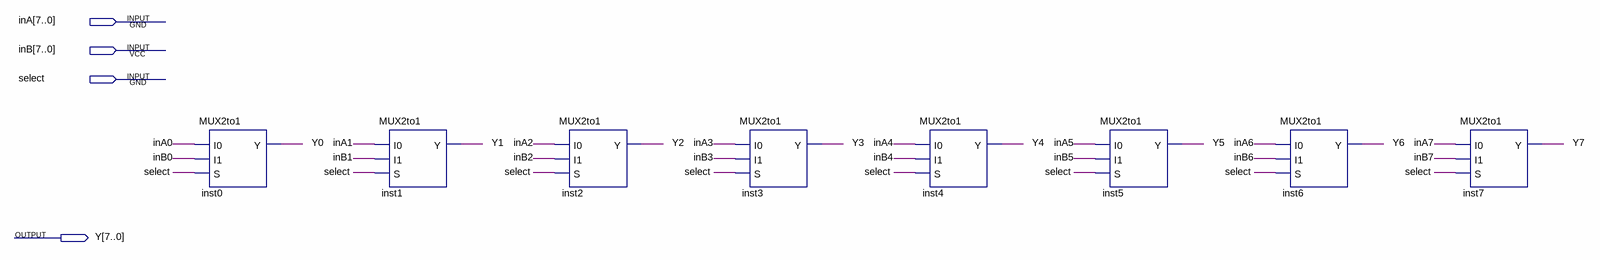
[diagram p0: schematic sheet]
// Quartus schematic MUX2to1BUS8.bdf as structural Verilog: 8 symbols, 4 pins
module MUX2to1BUS8 (
  input  [7:0] inA,
  input  [7:0] inB,
  input  select,
  output [7:0] Y
);

  MUX2to1 inst0 (.I0(inA[0]), .I1(inB[0]), .S(select), .Y(Y[0]));
  MUX2to1 inst1 (.I0(inA[1]), .I1(inB[1]), .S(select), .Y(Y[1]));
  MUX2to1 inst2 (.I0(inA[2]), .I1(inB[2]), .S(select), .Y(Y[2]));
  MUX2to1 inst3 (.I0(inA[3]), .I1(inB[3]), .S(select), .Y(Y[3]));
  MUX2to1 inst4 (.I0(inA[4]), .I1(inB[4]), .S(select), .Y(Y[4]));
  MUX2to1 inst5 (.I0(inA[5]), .I1(inB[5]), .S(select), .Y(Y[5]));
  MUX2to1 inst6 (.I0(inA[6]), .I1(inB[6]), .S(select), .Y(Y[6]));
  MUX2to1 inst7 (.I0(inA[7]), .I1(inB[7]), .S(select), .Y(Y[7]));
endmodule
